# EasyEDA Pro project CALU_BMS_1_2_0_0.epro, schematic Active_Balancer

## Sheets
1 P1: Board Name: Active Balancer; Create Date: 2025-09-23; Page Name: P1; Project Name: CALU_BMS; Schematic Name: Active_Balancer; Update Date: 2025-10-01; Company: EasyEDA.com; Page Size: A4; Version: V1.0
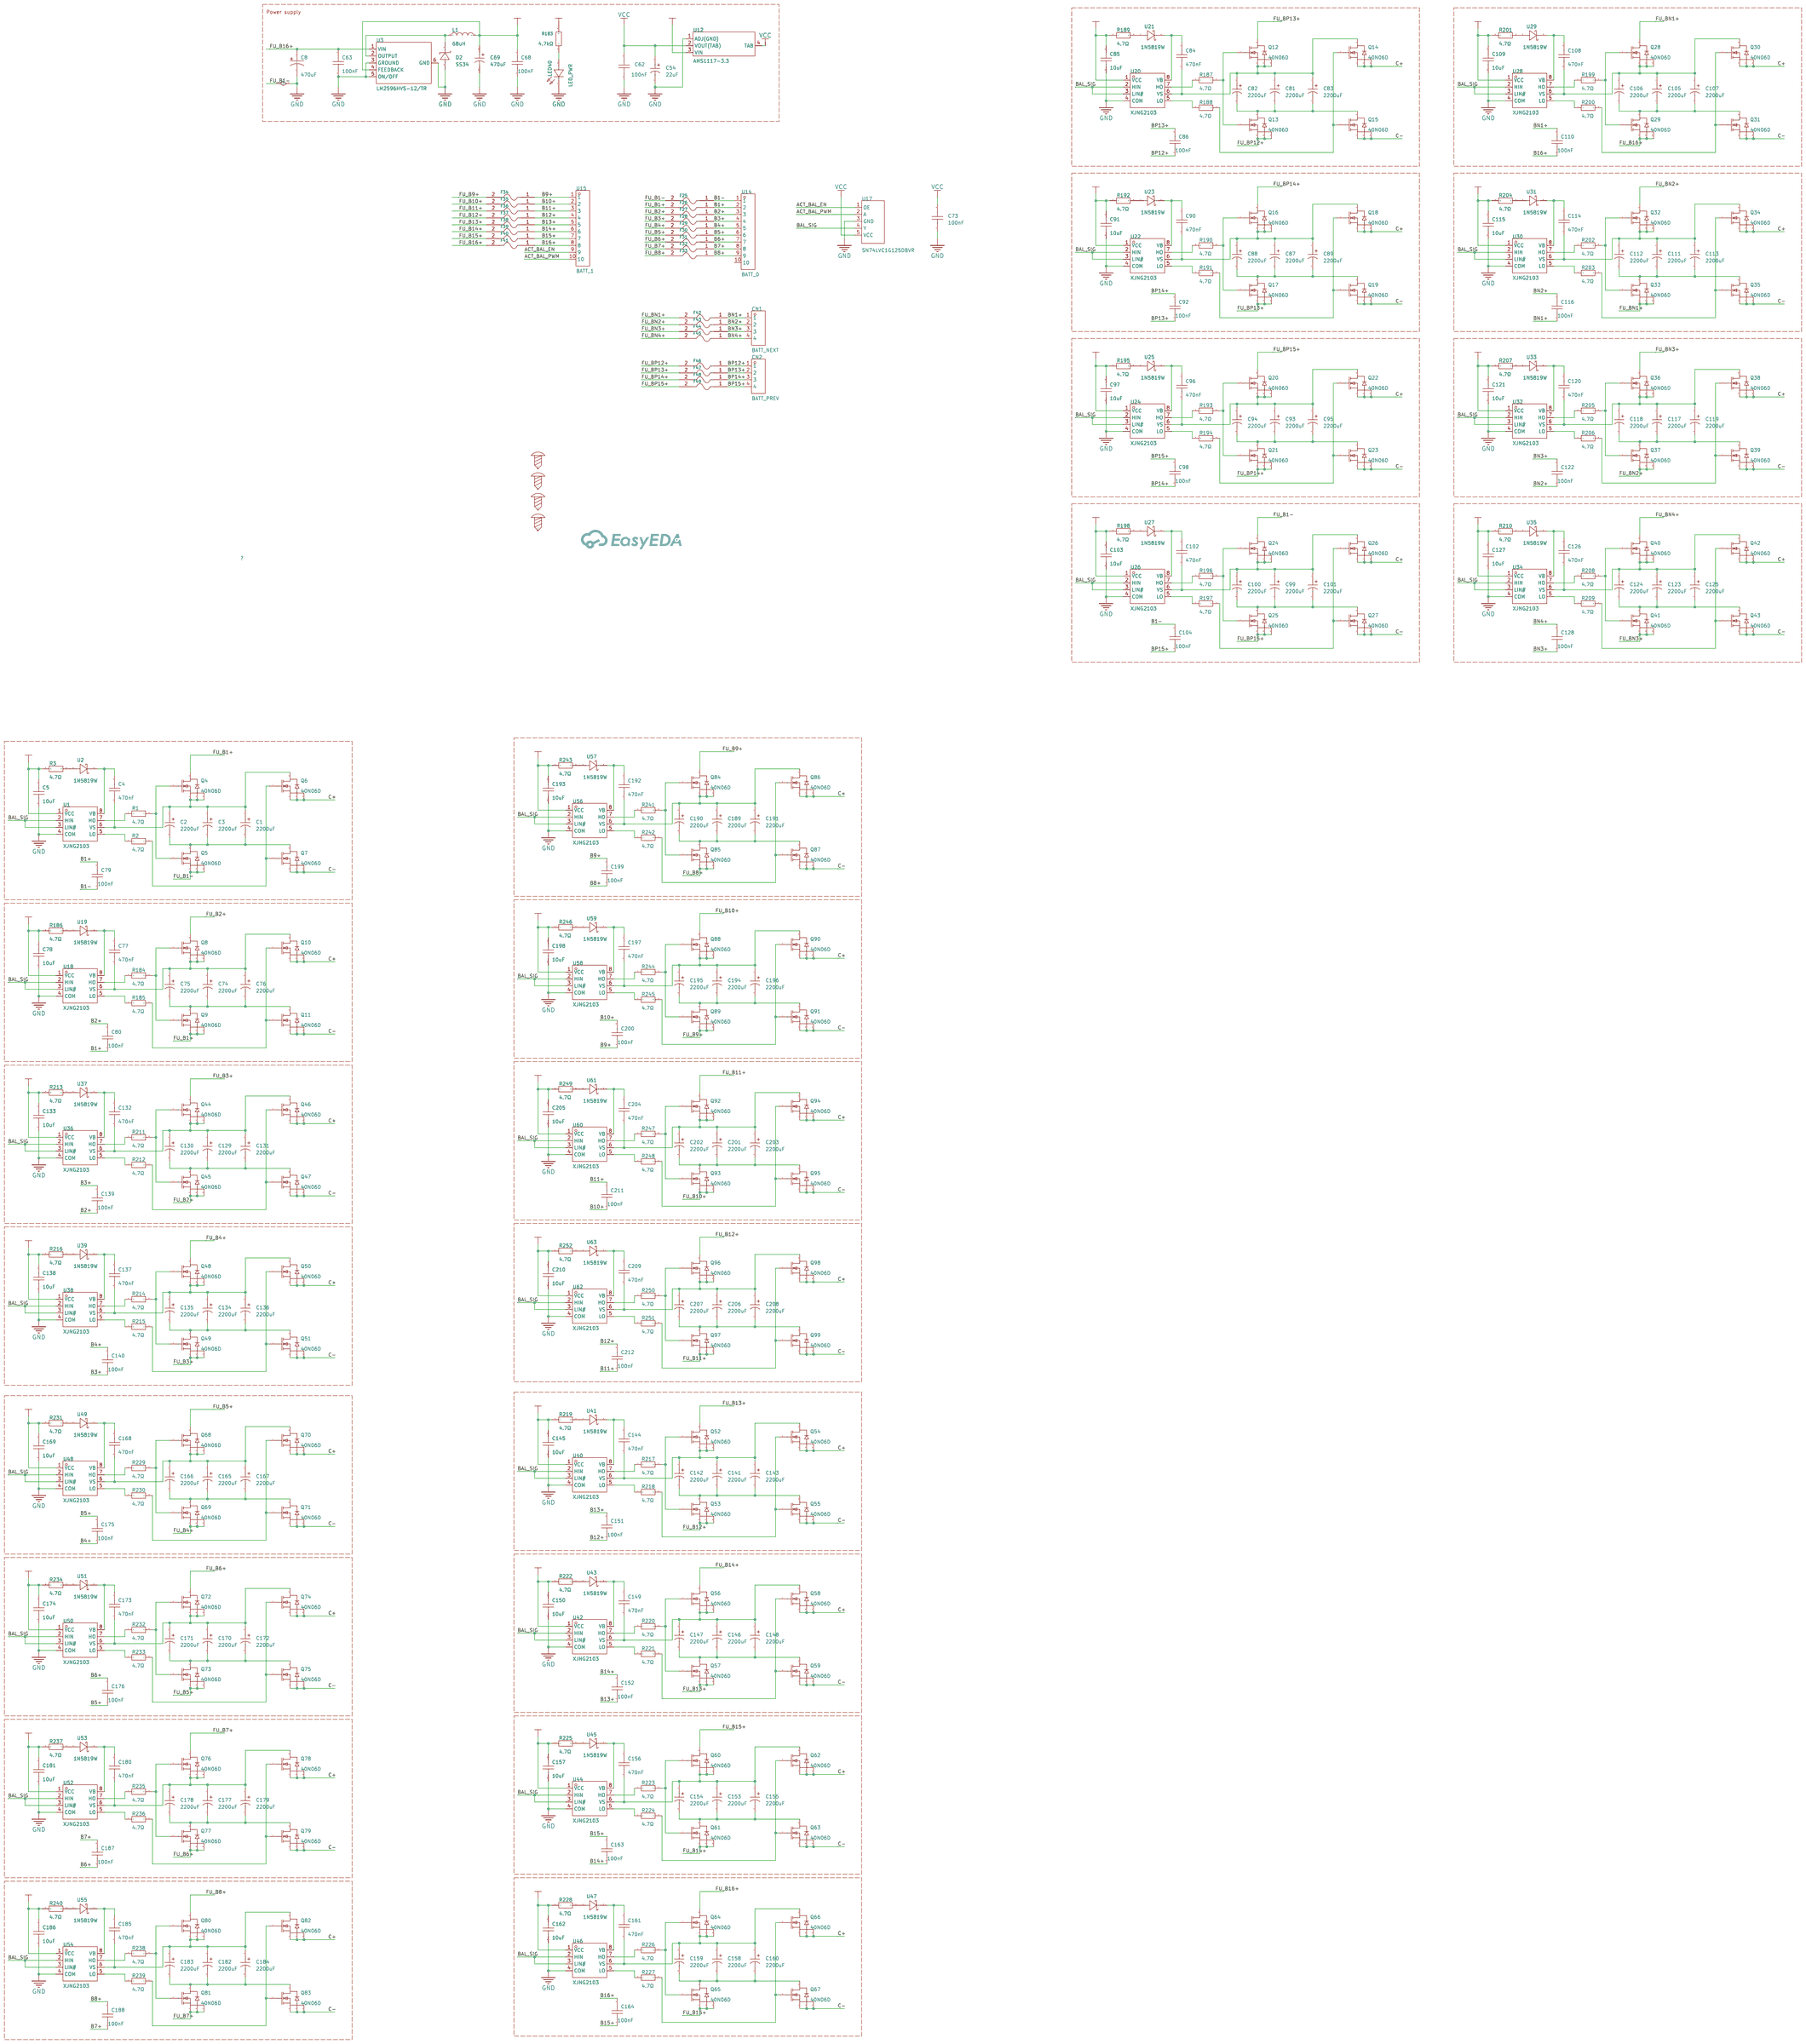
[diagram p4: P1]
2 P2: Project Name: Project Name; Schematic Name: Schematic Name; Update Date: 2021.11.05
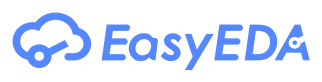
[diagram p5: P2]

## Parts
C1  2200uF  [CAP-SMD_BD10.0-L10.3-W10.3-LS11.0-FD]
C2  2200uF  [CAP-SMD_BD10.0-L10.3-W10.3-LS11.0-FD]
C3  2200uF  [CAP-SMD_BD10.0-L10.3-W10.3-LS11.0-FD]
C4  470nF  [C0603]
C5  10uF  [C0805]
C8  470uF  [CAP-SMD_BD16.0-L17.0-W17.0-FD-LS18.0]
C54  22uF  [CAP-SMD_BD5.0-L5.3-W5.3-LS6.0-FD]
C62  100nF  [C0603]
C63  100nF  [C0603]
C68  100nF  [C0603]
C69  470uF  [CAP-SMD_BD6.3-L6.6-W6.6-LS7.6-RD]
C73  100nF  [C0603]
C74  2200uF  [CAP-SMD_BD10.0-L10.3-W10.3-LS11.0-FD]
C75  2200uF  [CAP-SMD_BD10.0-L10.3-W10.3-LS11.0-FD]
C76  2200uF  [CAP-SMD_BD10.0-L10.3-W10.3-LS11.0-FD]
C77  470nF  [C0603]
C78  10uF  [C0805]
C79  100nF  [C0603]
C80  100nF  [C0603]
C81  2200uF  [CAP-SMD_BD10.0-L10.3-W10.3-LS11.0-FD]
C82  2200uF  [CAP-SMD_BD10.0-L10.3-W10.3-LS11.0-FD]
C83  2200uF  [CAP-SMD_BD10.0-L10.3-W10.3-LS11.0-FD]
C84  470nF  [C0603]
C85  10uF  [C0805]
C86  100nF  [C0603]
C87  2200uF  [CAP-SMD_BD10.0-L10.3-W10.3-LS11.0-FD]
C88  2200uF  [CAP-SMD_BD10.0-L10.3-W10.3-LS11.0-FD]
C89  2200uF  [CAP-SMD_BD10.0-L10.3-W10.3-LS11.0-FD]
C90  470nF  [C0603]
C91  10uF  [C0805]
C92  100nF  [C0603]
C93  2200uF  [CAP-SMD_BD10.0-L10.3-W10.3-LS11.0-FD]
C94  2200uF  [CAP-SMD_BD10.0-L10.3-W10.3-LS11.0-FD]
C95  2200uF  [CAP-SMD_BD10.0-L10.3-W10.3-LS11.0-FD]
C96  470nF  [C0603]
C97  10uF  [C0805]
C98  100nF  [C0603]
C99  2200uF  [CAP-SMD_BD10.0-L10.3-W10.3-LS11.0-FD]
C100  2200uF  [CAP-SMD_BD10.0-L10.3-W10.3-LS11.0-FD]
C101  2200uF  [CAP-SMD_BD10.0-L10.3-W10.3-LS11.0-FD]
C102  470nF  [C0603]
C103  10uF  [C0805]
C104  100nF  [C0603]
C105  2200uF  [CAP-SMD_BD10.0-L10.3-W10.3-LS11.0-FD]
C106  2200uF  [CAP-SMD_BD10.0-L10.3-W10.3-LS11.0-FD]
C107  2200uF  [CAP-SMD_BD10.0-L10.3-W10.3-LS11.0-FD]
C108  470nF  [C0603]
C109  10uF  [C0805]
C110  100nF  [C0603]
C111  2200uF  [CAP-SMD_BD10.0-L10.3-W10.3-LS11.0-FD]
C112  2200uF  [CAP-SMD_BD10.0-L10.3-W10.3-LS11.0-FD]
C113  2200uF  [CAP-SMD_BD10.0-L10.3-W10.3-LS11.0-FD]
C114  470nF  [C0603]
C115  10uF  [C0805]
C116  100nF  [C0603]
C117  2200uF  [CAP-SMD_BD10.0-L10.3-W10.3-LS11.0-FD]
C118  2200uF  [CAP-SMD_BD10.0-L10.3-W10.3-LS11.0-FD]
C119  2200uF  [CAP-SMD_BD10.0-L10.3-W10.3-LS11.0-FD]
C120  470nF  [C0603]
C121  10uF  [C0805]
C122  100nF  [C0603]
C123  2200uF  [CAP-SMD_BD10.0-L10.3-W10.3-LS11.0-FD]
C124  2200uF  [CAP-SMD_BD10.0-L10.3-W10.3-LS11.0-FD]
C125  2200uF  [CAP-SMD_BD10.0-L10.3-W10.3-LS11.0-FD]
C126  470nF  [C0603]
C127  10uF  [C0805]
C128  100nF  [C0603]
C129  2200uF  [CAP-SMD_BD10.0-L10.3-W10.3-LS11.0-FD]
C130  2200uF  [CAP-SMD_BD10.0-L10.3-W10.3-LS11.0-FD]
C131  2200uF  [CAP-SMD_BD10.0-L10.3-W10.3-LS11.0-FD]
C132  470nF  [C0603]
C133  10uF  [C0805]
C134  2200uF  [CAP-SMD_BD10.0-L10.3-W10.3-LS11.0-FD]
C135  2200uF  [CAP-SMD_BD10.0-L10.3-W10.3-LS11.0-FD]
C136  2200uF  [CAP-SMD_BD10.0-L10.3-W10.3-LS11.0-FD]
C137  470nF  [C0603]
C138  10uF  [C0805]
C139  100nF  [C0603]
C140  100nF  [C0603]
C141  2200uF  [CAP-SMD_BD10.0-L10.3-W10.3-LS11.0-FD]
C142  2200uF  [CAP-SMD_BD10.0-L10.3-W10.3-LS11.0-FD]
C143  2200uF  [CAP-SMD_BD10.0-L10.3-W10.3-LS11.0-FD]
C144  470nF  [C0603]
C145  10uF  [C0805]
C146  2200uF  [CAP-SMD_BD10.0-L10.3-W10.3-LS11.0-FD]
C147  2200uF  [CAP-SMD_BD10.0-L10.3-W10.3-LS11.0-FD]
C148  2200uF  [CAP-SMD_BD10.0-L10.3-W10.3-LS11.0-FD]
C149  470nF  [C0603]
C150  10uF  [C0805]
C151  100nF  [C0603]
C152  100nF  [C0603]
C153  2200uF  [CAP-SMD_BD10.0-L10.3-W10.3-LS11.0-FD]
C154  2200uF  [CAP-SMD_BD10.0-L10.3-W10.3-LS11.0-FD]
C155  2200uF  [CAP-SMD_BD10.0-L10.3-W10.3-LS11.0-FD]
C156  470nF  [C0603]
C157  10uF  [C0805]
C158  2200uF  [CAP-SMD_BD10.0-L10.3-W10.3-LS11.0-FD]
C159  2200uF  [CAP-SMD_BD10.0-L10.3-W10.3-LS11.0-FD]
C160  2200uF  [CAP-SMD_BD10.0-L10.3-W10.3-LS11.0-FD]
C161  470nF  [C0603]
C162  10uF  [C0805]
C163  100nF  [C0603]
C164  100nF  [C0603]
C165  2200uF  [CAP-SMD_BD10.0-L10.3-W10.3-LS11.0-FD]
C166  2200uF  [CAP-SMD_BD10.0-L10.3-W10.3-LS11.0-FD]
C167  2200uF  [CAP-SMD_BD10.0-L10.3-W10.3-LS11.0-FD]
C168  470nF  [C0603]
C169  10uF  [C0805]
C170  2200uF  [CAP-SMD_BD10.0-L10.3-W10.3-LS11.0-FD]
C171  2200uF  [CAP-SMD_BD10.0-L10.3-W10.3-LS11.0-FD]
C172  2200uF  [CAP-SMD_BD10.0-L10.3-W10.3-LS11.0-FD]
C173  470nF  [C0603]
C174  10uF  [C0805]
C175  100nF  [C0603]
C176  100nF  [C0603]
C177  2200uF  [CAP-SMD_BD10.0-L10.3-W10.3-LS11.0-FD]
C178  2200uF  [CAP-SMD_BD10.0-L10.3-W10.3-LS11.0-FD]
C179  2200uF  [CAP-SMD_BD10.0-L10.3-W10.3-LS11.0-FD]
C180  470nF  [C0603]
C181  10uF  [C0805]
C182  2200uF  [CAP-SMD_BD10.0-L10.3-W10.3-LS11.0-FD]
C183  2200uF  [CAP-SMD_BD10.0-L10.3-W10.3-LS11.0-FD]
C184  2200uF  [CAP-SMD_BD10.0-L10.3-W10.3-LS11.0-FD]
C185  470nF  [C0603]
C186  10uF  [C0805]
C187  100nF  [C0603]
C188  100nF  [C0603]
C189  2200uF  [CAP-SMD_BD10.0-L10.3-W10.3-LS11.0-FD]
C190  2200uF  [CAP-SMD_BD10.0-L10.3-W10.3-LS11.0-FD]
C191  2200uF  [CAP-SMD_BD10.0-L10.3-W10.3-LS11.0-FD]
C192  470nF  [C0603]
C193  10uF  [C0805]
C194  2200uF  [CAP-SMD_BD10.0-L10.3-W10.3-LS11.0-FD]
C195  2200uF  [CAP-SMD_BD10.0-L10.3-W10.3-LS11.0-FD]
C196  2200uF  [CAP-SMD_BD10.0-L10.3-W10.3-LS11.0-FD]
C197  470nF  [C0603]
C198  10uF  [C0805]
C199  100nF  [C0603]
C200  100nF  [C0603]
C201  2200uF  [CAP-SMD_BD10.0-L10.3-W10.3-LS11.0-FD]
C202  2200uF  [CAP-SMD_BD10.0-L10.3-W10.3-LS11.0-FD]
C203  2200uF  [CAP-SMD_BD10.0-L10.3-W10.3-LS11.0-FD]
C204  470nF  [C0603]
C205  10uF  [C0805]
C206  2200uF  [CAP-SMD_BD10.0-L10.3-W10.3-LS11.0-FD]
C207  2200uF  [CAP-SMD_BD10.0-L10.3-W10.3-LS11.0-FD]
C208  2200uF  [CAP-SMD_BD10.0-L10.3-W10.3-LS11.0-FD]
C209  470nF  [C0603]
C210  10uF  [C0805]
C211  100nF  [C0603]
C212  100nF  [C0603]
CN1  BATT_NEXT  [CONN-TH_4P-P3.50_MAX_MX15EDGRM-3.5-04P-GN01-CU-A]
CN2  BATT_PREV  [CONN-TH_4P-P3.50_MAX_MX15EDGRM-3.5-04P-GN01-CU-A]
D2  SS34  [SMA_L4.3-W2.6-LS5.2-RD]
F25  SMD1206P005TF  [F1206]
F26  SMD1206P005TF  [F1206]
F27  SMD1206P005TF  [F1206]
F28  SMD1206P005TF  [F1206]
F29  SMD1206P005TF  [F1206]
F30  SMD1206P005TF  [F1206]
F31  SMD1206P005TF  [F1206]
F32  SMD1206P005TF  [F1206]
F33  SMD1206P005TF  [F1206]
F34  SMD1206P005TF  [F1206]
F35  SMD1206P005TF  [F1206]
F36  SMD1206P005TF  [F1206]
F37  SMD1206P005TF  [F1206]
F38  SMD1206P005TF  [F1206]
F39  SMD1206P005TF  [F1206]
F40  SMD1206P005TF  [F1206]
F41  SMD1206P005TF  [F1206]
F42  SMD1206P005TF  [F1206]
F43  SMD1206P005TF  [F1206]
F44  SMD1206P005TF  [F1206]
F45  SMD1206P005TF  [F1206]
F46  SMD1206P005TF  [F1206]
F47  SMD1206P005TF  [F1206]
F48  SMD1206P005TF  [F1206]
F49  SMD1206P005TF  [F1206]
L1  68uH  [IND-SMD_L12.5-W12.5]
LED40  LED_PWR  [LED0603-RD-YELLOW]
Q4  40N06D  [WDFN-5_L3.1-W3.1-P0.65-BL_1]
Q5  40N06D  [WDFN-5_L3.1-W3.1-P0.65-BL_1]
Q6  40N06D  [WDFN-5_L3.1-W3.1-P0.65-BL_1]
Q7  40N06D  [WDFN-5_L3.1-W3.1-P0.65-BL_1]
Q8  40N06D  [WDFN-5_L3.1-W3.1-P0.65-BL_1]
Q9  40N06D  [WDFN-5_L3.1-W3.1-P0.65-BL_1]
Q10  40N06D  [WDFN-5_L3.1-W3.1-P0.65-BL_1]
Q11  40N06D  [WDFN-5_L3.1-W3.1-P0.65-BL_1]
Q12  40N06D  [WDFN-5_L3.1-W3.1-P0.65-BL_1]
Q13  40N06D  [WDFN-5_L3.1-W3.1-P0.65-BL_1]
Q14  40N06D  [WDFN-5_L3.1-W3.1-P0.65-BL_1]
Q15  40N06D  [WDFN-5_L3.1-W3.1-P0.65-BL_1]
Q16  40N06D  [WDFN-5_L3.1-W3.1-P0.65-BL_1]
Q17  40N06D  [WDFN-5_L3.1-W3.1-P0.65-BL_1]
Q18  40N06D  [WDFN-5_L3.1-W3.1-P0.65-BL_1]
Q19  40N06D  [WDFN-5_L3.1-W3.1-P0.65-BL_1]
Q20  40N06D  [WDFN-5_L3.1-W3.1-P0.65-BL_1]
Q21  40N06D  [WDFN-5_L3.1-W3.1-P0.65-BL_1]
Q22  40N06D  [WDFN-5_L3.1-W3.1-P0.65-BL_1]
Q23  40N06D  [WDFN-5_L3.1-W3.1-P0.65-BL_1]
Q24  40N06D  [WDFN-5_L3.1-W3.1-P0.65-BL_1]
Q25  40N06D  [WDFN-5_L3.1-W3.1-P0.65-BL_1]
Q26  40N06D  [WDFN-5_L3.1-W3.1-P0.65-BL_1]
Q27  40N06D  [WDFN-5_L3.1-W3.1-P0.65-BL_1]
Q28  40N06D  [WDFN-5_L3.1-W3.1-P0.65-BL_1]
Q29  40N06D  [WDFN-5_L3.1-W3.1-P0.65-BL_1]
Q30  40N06D  [WDFN-5_L3.1-W3.1-P0.65-BL_1]
Q31  40N06D  [WDFN-5_L3.1-W3.1-P0.65-BL_1]
Q32  40N06D  [WDFN-5_L3.1-W3.1-P0.65-BL_1]
Q33  40N06D  [WDFN-5_L3.1-W3.1-P0.65-BL_1]
Q34  40N06D  [WDFN-5_L3.1-W3.1-P0.65-BL_1]
Q35  40N06D  [WDFN-5_L3.1-W3.1-P0.65-BL_1]
Q36  40N06D  [WDFN-5_L3.1-W3.1-P0.65-BL_1]
Q37  40N06D  [WDFN-5_L3.1-W3.1-P0.65-BL_1]
Q38  40N06D  [WDFN-5_L3.1-W3.1-P0.65-BL_1]
Q39  40N06D  [WDFN-5_L3.1-W3.1-P0.65-BL_1]
Q40  40N06D  [WDFN-5_L3.1-W3.1-P0.65-BL_1]
Q41  40N06D  [WDFN-5_L3.1-W3.1-P0.65-BL_1]
Q42  40N06D  [WDFN-5_L3.1-W3.1-P0.65-BL_1]
Q43  40N06D  [WDFN-5_L3.1-W3.1-P0.65-BL_1]
Q44  40N06D  [WDFN-5_L3.1-W3.1-P0.65-BL_1]
Q45  40N06D  [WDFN-5_L3.1-W3.1-P0.65-BL_1]
Q46  40N06D  [WDFN-5_L3.1-W3.1-P0.65-BL_1]
Q47  40N06D  [WDFN-5_L3.1-W3.1-P0.65-BL_1]
Q48  40N06D  [WDFN-5_L3.1-W3.1-P0.65-BL_1]
Q49  40N06D  [WDFN-5_L3.1-W3.1-P0.65-BL_1]
Q50  40N06D  [WDFN-5_L3.1-W3.1-P0.65-BL_1]
Q51  40N06D  [WDFN-5_L3.1-W3.1-P0.65-BL_1]
Q52  40N06D  [WDFN-5_L3.1-W3.1-P0.65-BL_1]
Q53  40N06D  [WDFN-5_L3.1-W3.1-P0.65-BL_1]
Q54  40N06D  [WDFN-5_L3.1-W3.1-P0.65-BL_1]
Q55  40N06D  [WDFN-5_L3.1-W3.1-P0.65-BL_1]
Q56  40N06D  [WDFN-5_L3.1-W3.1-P0.65-BL_1]
Q57  40N06D  [WDFN-5_L3.1-W3.1-P0.65-BL_1]
Q58  40N06D  [WDFN-5_L3.1-W3.1-P0.65-BL_1]
Q59  40N06D  [WDFN-5_L3.1-W3.1-P0.65-BL_1]
Q60  40N06D  [WDFN-5_L3.1-W3.1-P0.65-BL_1]
Q61  40N06D  [WDFN-5_L3.1-W3.1-P0.65-BL_1]
Q62  40N06D  [WDFN-5_L3.1-W3.1-P0.65-BL_1]
Q63  40N06D  [WDFN-5_L3.1-W3.1-P0.65-BL_1]
Q64  40N06D  [WDFN-5_L3.1-W3.1-P0.65-BL_1]
Q65  40N06D  [WDFN-5_L3.1-W3.1-P0.65-BL_1]
Q66  40N06D  [WDFN-5_L3.1-W3.1-P0.65-BL_1]
Q67  40N06D  [WDFN-5_L3.1-W3.1-P0.65-BL_1]
Q68  40N06D  [WDFN-5_L3.1-W3.1-P0.65-BL_1]
Q69  40N06D  [WDFN-5_L3.1-W3.1-P0.65-BL_1]
Q70  40N06D  [WDFN-5_L3.1-W3.1-P0.65-BL_1]
Q71  40N06D  [WDFN-5_L3.1-W3.1-P0.65-BL_1]
Q72  40N06D  [WDFN-5_L3.1-W3.1-P0.65-BL_1]
Q73  40N06D  [WDFN-5_L3.1-W3.1-P0.65-BL_1]
Q74  40N06D  [WDFN-5_L3.1-W3.1-P0.65-BL_1]
Q75  40N06D  [WDFN-5_L3.1-W3.1-P0.65-BL_1]
Q76  40N06D  [WDFN-5_L3.1-W3.1-P0.65-BL_1]
Q77  40N06D  [WDFN-5_L3.1-W3.1-P0.65-BL_1]
Q78  40N06D  [WDFN-5_L3.1-W3.1-P0.65-BL_1]
Q79  40N06D  [WDFN-5_L3.1-W3.1-P0.65-BL_1]
Q80  40N06D  [WDFN-5_L3.1-W3.1-P0.65-BL_1]
Q81  40N06D  [WDFN-5_L3.1-W3.1-P0.65-BL_1]
Q82  40N06D  [WDFN-5_L3.1-W3.1-P0.65-BL_1]
Q83  40N06D  [WDFN-5_L3.1-W3.1-P0.65-BL_1]
Q84  40N06D  [WDFN-5_L3.1-W3.1-P0.65-BL_1]
Q85  40N06D  [WDFN-5_L3.1-W3.1-P0.65-BL_1]
Q86  40N06D  [WDFN-5_L3.1-W3.1-P0.65-BL_1]
Q87  40N06D  [WDFN-5_L3.1-W3.1-P0.65-BL_1]
Q88  40N06D  [WDFN-5_L3.1-W3.1-P0.65-BL_1]
Q89  40N06D  [WDFN-5_L3.1-W3.1-P0.65-BL_1]
Q90  40N06D  [WDFN-5_L3.1-W3.1-P0.65-BL_1]
Q91  40N06D  [WDFN-5_L3.1-W3.1-P0.65-BL_1]
Q92  40N06D  [WDFN-5_L3.1-W3.1-P0.65-BL_1]
Q93  40N06D  [WDFN-5_L3.1-W3.1-P0.65-BL_1]
Q94  40N06D  [WDFN-5_L3.1-W3.1-P0.65-BL_1]
Q95  40N06D  [WDFN-5_L3.1-W3.1-P0.65-BL_1]
Q96  40N06D  [WDFN-5_L3.1-W3.1-P0.65-BL_1]
Q97  40N06D  [WDFN-5_L3.1-W3.1-P0.65-BL_1]
Q98  40N06D  [WDFN-5_L3.1-W3.1-P0.65-BL_1]
Q99  40N06D  [WDFN-5_L3.1-W3.1-P0.65-BL_1]
R1  4.7Ω  [R0603]
R2  4.7Ω  [R0603]
R3  4.7Ω  [R0603]
R183  4.7kΩ  [R0603]
R184  4.7Ω  [R0603]
R185  4.7Ω  [R0603]
R186  4.7Ω  [R0603]
R187  4.7Ω  [R0603]
R188  4.7Ω  [R0603]
R189  4.7Ω  [R0603]
R190  4.7Ω  [R0603]
R191  4.7Ω  [R0603]
R192  4.7Ω  [R0603]
R193  4.7Ω  [R0603]
R194  4.7Ω  [R0603]
R195  4.7Ω  [R0603]
R196  4.7Ω  [R0603]
R197  4.7Ω  [R0603]
R198  4.7Ω  [R0603]
R199  4.7Ω  [R0603]
R200  4.7Ω  [R0603]
R201  4.7Ω  [R0603]
R202  4.7Ω  [R0603]
R203  4.7Ω  [R0603]
R204  4.7Ω  [R0603]
R205  4.7Ω  [R0603]
R206  4.7Ω  [R0603]
R207  4.7Ω  [R0603]
R208  4.7Ω  [R0603]
R209  4.7Ω  [R0603]
R210  4.7Ω  [R0603]
R211  4.7Ω  [R0603]
R212  4.7Ω  [R0603]
R213  4.7Ω  [R0603]
R214  4.7Ω  [R0603]
R215  4.7Ω  [R0603]
R216  4.7Ω  [R0603]
R217  4.7Ω  [R0603]
R218  4.7Ω  [R0603]
R219  4.7Ω  [R0603]
R220  4.7Ω  [R0603]
R221  4.7Ω  [R0603]
R222  4.7Ω  [R0603]
R223  4.7Ω  [R0603]
R224  4.7Ω  [R0603]
R225  4.7Ω  [R0603]
R226  4.7Ω  [R0603]
R227  4.7Ω  [R0603]
R228  4.7Ω  [R0603]
R229  4.7Ω  [R0603]
R230  4.7Ω  [R0603]
R231  4.7Ω  [R0603]
R232  4.7Ω  [R0603]
R233  4.7Ω  [R0603]
R234  4.7Ω  [R0603]
R235  4.7Ω  [R0603]
R236  4.7Ω  [R0603]
R237  4.7Ω  [R0603]
R238  4.7Ω  [R0603]
R239  4.7Ω  [R0603]
R240  4.7Ω  [R0603]
R241  4.7Ω  [R0603]
R242  4.7Ω  [R0603]
R243  4.7Ω  [R0603]
R244  4.7Ω  [R0603]
R245  4.7Ω  [R0603]
R246  4.7Ω  [R0603]
R247  4.7Ω  [R0603]
R248  4.7Ω  [R0603]
R249  4.7Ω  [R0603]
R250  4.7Ω  [R0603]
R251  4.7Ω  [R0603]
R252  4.7Ω  [R0603]
SCREW1  -  [Screw-Hole-M4]
SCREW2  -  [Screw-Hole-M4]
SCREW3  -  [Screw-Hole-M4]
SCREW4  -  [Screw-Hole-M4]
U1  XJNG2103  [SOIC-8_L4.9-W3.9-P1.27-LS6.0-BL]
U2  1N5819W  [SOD-123_L2.7-W1.6-LS3.7-FD]
U3  LM2596HVS-12/TR  [TO-263-5_L10.6-W9.6-P1.70-LS15.9-BR]
U12  AMS1117-3.3  [SOT-223-4_L6.5-W3.5-P2.30-LS7.0-BR]
U14  BATT_0  [CONN-TH_10P-P3.50_MX15EDGRM-3.5-10P-GN01-CU-A]
U15  BATT_1  [CONN-TH_10P-P3.50_MX15EDGRM-3.5-10P-GN01-CU-A]
U17  SN74LVC1G125DBVR  [SOT-23-5_L3.0-W1.7-P0.95-LS2.8-BL]
U18  XJNG2103  [SOIC-8_L4.9-W3.9-P1.27-LS6.0-BL]
U19  1N5819W  [SOD-123_L2.7-W1.6-LS3.7-FD]
U20  XJNG2103  [SOIC-8_L4.9-W3.9-P1.27-LS6.0-BL]
U21  1N5819W  [SOD-123_L2.7-W1.6-LS3.7-FD]
U22  XJNG2103  [SOIC-8_L4.9-W3.9-P1.27-LS6.0-BL]
U23  1N5819W  [SOD-123_L2.7-W1.6-LS3.7-FD]
U24  XJNG2103  [SOIC-8_L4.9-W3.9-P1.27-LS6.0-BL]
U25  1N5819W  [SOD-123_L2.7-W1.6-LS3.7-FD]
U26  XJNG2103  [SOIC-8_L4.9-W3.9-P1.27-LS6.0-BL]
U27  1N5819W  [SOD-123_L2.7-W1.6-LS3.7-FD]
U28  XJNG2103  [SOIC-8_L4.9-W3.9-P1.27-LS6.0-BL]
U29  1N5819W  [SOD-123_L2.7-W1.6-LS3.7-FD]
U30  XJNG2103  [SOIC-8_L4.9-W3.9-P1.27-LS6.0-BL]
U31  1N5819W  [SOD-123_L2.7-W1.6-LS3.7-FD]
U32  XJNG2103  [SOIC-8_L4.9-W3.9-P1.27-LS6.0-BL]
U33  1N5819W  [SOD-123_L2.7-W1.6-LS3.7-FD]
U34  XJNG2103  [SOIC-8_L4.9-W3.9-P1.27-LS6.0-BL]
U35  1N5819W  [SOD-123_L2.7-W1.6-LS3.7-FD]
U36  XJNG2103  [SOIC-8_L4.9-W3.9-P1.27-LS6.0-BL]
U37  1N5819W  [SOD-123_L2.7-W1.6-LS3.7-FD]
U38  XJNG2103  [SOIC-8_L4.9-W3.9-P1.27-LS6.0-BL]
U39  1N5819W  [SOD-123_L2.7-W1.6-LS3.7-FD]
U40  XJNG2103  [SOIC-8_L4.9-W3.9-P1.27-LS6.0-BL]
U41  1N5819W  [SOD-123_L2.7-W1.6-LS3.7-FD]
U42  XJNG2103  [SOIC-8_L4.9-W3.9-P1.27-LS6.0-BL]
U43  1N5819W  [SOD-123_L2.7-W1.6-LS3.7-FD]
U44  XJNG2103  [SOIC-8_L4.9-W3.9-P1.27-LS6.0-BL]
U45  1N5819W  [SOD-123_L2.7-W1.6-LS3.7-FD]
U46  XJNG2103  [SOIC-8_L4.9-W3.9-P1.27-LS6.0-BL]
U47  1N5819W  [SOD-123_L2.7-W1.6-LS3.7-FD]
U48  XJNG2103  [SOIC-8_L4.9-W3.9-P1.27-LS6.0-BL]
U49  1N5819W  [SOD-123_L2.7-W1.6-LS3.7-FD]
U50  XJNG2103  [SOIC-8_L4.9-W3.9-P1.27-LS6.0-BL]
U51  1N5819W  [SOD-123_L2.7-W1.6-LS3.7-FD]
U52  XJNG2103  [SOIC-8_L4.9-W3.9-P1.27-LS6.0-BL]
U53  1N5819W  [SOD-123_L2.7-W1.6-LS3.7-FD]
U54  XJNG2103  [SOIC-8_L4.9-W3.9-P1.27-LS6.0-BL]
U55  1N5819W  [SOD-123_L2.7-W1.6-LS3.7-FD]
U56  XJNG2103  [SOIC-8_L4.9-W3.9-P1.27-LS6.0-BL]
U57  1N5819W  [SOD-123_L2.7-W1.6-LS3.7-FD]
U58  XJNG2103  [SOIC-8_L4.9-W3.9-P1.27-LS6.0-BL]
U59  1N5819W  [SOD-123_L2.7-W1.6-LS3.7-FD]
U60  XJNG2103  [SOIC-8_L4.9-W3.9-P1.27-LS6.0-BL]
U61  1N5819W  [SOD-123_L2.7-W1.6-LS3.7-FD]
U62  XJNG2103  [SOIC-8_L4.9-W3.9-P1.27-LS6.0-BL]
U63  1N5819W  [SOD-123_L2.7-W1.6-LS3.7-FD]

## Library data of the parts
C1-C3 C74-C76 C81-C83 C87-C89 C93-C95 C99-C101 C105-C107 C111-C113 C117-C119 C123-C125 C129-C131 C134-C136 C141-C143 C146-C148 C153-C155 C158-C160 C165-C167 C170-C172 C177-C179 C182-C184 C189-C191 C194-C196 C201-C203 C206-C208 = GVM0J228M1010CN: Capacitance:2200uF Tolerance:±20% Tolerance:±20% Voltage Rating:6.3V Ripple Current:1.19A@100kHz Diameter:10mm Height - Seated (Max):10.5mm; LCSC Part Name: 2200uF ±20% 6.3V; Supplier Part: C22383517; Manufacturer: ACMECON(鼎容); Supplier Footprint: SMD,D10xL10.5mm; JLCPCB Part Class: Extended Part; Datasheet: https://item.szlcsc.com/datasheet/GVM0J228M1010CN/23927502.html; Supplier: LCSC; Tolerance: ±20%; Voltage Rating: 6.3V; Ripple Current: 1.19A@100kHz; Diameter: 10mm; Height - Seated (Max): 10.5mm
C4 C77 C84 C90 C96 C102 C108 C114 C120 C126 C132 C137 C144 C149 C156 C161 C168 C173 C180 C185 C192 C197 C204 C209 = CAP_0603: Supplier Footprint: 0603
C5 C78 C85 C91 C97 C103 C109 C115 C121 C127 C133 C138 C145 C150 C157 C162 C169 C174 C181 C186 C193 C198 C205 C210 = CAP_0805: Supplier Footprint: 0805
C8 = VZH471M1JTR-1616: Capacitance:470uF Tolerance:±20% Tolerance:±20% Voltage Rating:63V Ripple Current:- Equivalent Series Resistance(ESR):- Diameter:16mm Height - Seated (Max):16.5mm Lifetime:5000hrs@105℃ Operating Temperature:-45℃~+105℃ Operating Temperature:-45℃~+105℃; LCSC Part Name: 470uF ±20% 63V; Supplier Part: C249935; Manufacturer: Lelon(立隆); Supplier Footprint: SMD,D16xL16.5mm; JLCPCB Part Class: Extended Part; Datasheet: https://atta.szlcsc.com/upload/public/pdf/source/20181115/C249956_178B4AAE514BBF17AF6A9453F96D6C96.pdf; Supplier: LCSC; Tolerance: ±20%; Voltage Rating: 63V; Diameter: 16mm; Height - Seated (Max): 16.5mm; Lifetime: 5000hrs@105℃; Operating Temperature: -45℃~+105℃
C54 = CS1E220M-CRD54_C3001207: Capacitance:22uF Tolerance:±20% Tolerance:±20% Voltage Rating:25V Ripple Current:25mA@120Hz Diameter:5mm Height - Seated (Max):5.4mm Lifetime:2000hrs@105℃ Operating Temperature:-40℃~+105℃ Operating Temperature:-40℃~+105℃; LCSC Part Name: 22uF ±20% 25V; Supplier Part: C3001207; Manufacturer: ROQANG(容强); Manufacturer Part: CS1E220M-CRD54; Supplier Footprint: SMD,D5xL5.4mm; JLCPCB Part Class: Extended Part; Datasheet: https://item.szlcsc.com/datasheet/CS1E220M-CRD54/3483887.html; Supplier: LCSC; Tolerance: ±20%; Voltage Rating: 25V; Ripple Current: 25mA@120Hz; Diameter: 5mm; Height - Seated (Max): 5.4mm; Lifetime: 2000hrs@105℃; Operating Temperature: -40℃~+105℃
C62 C63 C68 C73 C79 C80 C86 C92 C98 C104 C110 C116 C122 C128 C139 C140 C151 C152 C163 C164 C175 C176 C187 C188 C199 C200 C211 C212 = CC0603KRX7R9BB104: Capacitance:100nF Tolerance:±10% Tolerance:±10% Voltage Rating:50V Temperature Coefficient:X7R; LCSC Part Name: 100nF ±10% 50V; Supplier Part: C14663; Manufacturer: YAGEO(国巨); Supplier Footprint: 0603; JLCPCB Part Class: Basic Part; Datasheet: https://item.szlcsc.com/datasheet/CC0603KRX7R9BB104/15331.html; Supplier: LCSC; Tolerance: ±10%; Voltage Rating: 50V; Temperature Coefficient: X7R
C69 = RVT1C471M0607: Capacitance:470uF Tolerance:±20% Tolerance:±20% Voltage Rating:16V Ripple Current:185mA@120Hz Diameter:6.3mm Height - Seated (Max):7.7mm Lifetime:2000hrs@105℃ Operating Temperature:-40℃~+105℃ Operating Temperature:-40℃~+105℃; LCSC Part Name: 470uF ±20% 16V; Supplier Part: C2977552; Manufacturer: ROQANG(容强); Supplier Footprint: SMD,D6.3xL7.7mm; JLCPCB Part Class: Extended Part; Datasheet: https://item.szlcsc.com/datasheet/RVT1C471M0607/3388608.html; Supplier: LCSC; Tolerance: ±20%; Voltage Rating: 16V; Ripple Current: 185mA@120Hz; Diameter: 6.3mm; Height - Seated (Max): 7.7mm; Lifetime: 2000hrs@105℃; Operating Temperature: -40℃~+105℃
CN1 CN2 = MX15EDGRM-3.5-04P-GN01-Cu-A: Connector Type:Board Side/Socket - Closed Termination Style:Screw Number of Positions or Pins:1x4P Pitch:3.5mm Color:Green Mounting Type:Right-Angle Pin Number of Pins:4P Number of Rows:1 Number of PINs Per Row:4 Current Rating:8A Voltage Rating (Max):300; LCSC Part Name: 螺丝固定 1x4P 3.5mm 排数:1 每排P数:4; Supplier Part: C5188343; Manufacturer: MAX(迈旭); Supplier Footprint: 弯插,P=3.5mm; JLCPCB Part Class: Extended Part; Datasheet: https://item.szlcsc.com/datasheet/MX15EDGRM-3.5-04P-GN01-Cu-A/5862427.html; Supplier: LCSC; Connector Type: Board Side/Socket - Closed; Termination Style: Screw; Number of Positions or Pins: 1x4P; Pitch: 3.5mm; Color: Green; Mounting Type: Right-Angle Pin; Number of Pins: 4P; Number of Rows: 1; Number of PINs Per Row: 4; Current Rating: 8A; Voltage Rating (Max): 300V; Operating Temperature: -40℃~+105℃
D2 = SS34_C8678: Diode Configuration:Independent Voltage - Forward(Vf@If):550mV@3A Voltage - DC Reverse(Vr):40V Current - Rectified:3A Reverse Leakage Current (Ir):500uA@40V Operating Junction Temperature Range:-55℃~+125℃ Operating Junction Temperature Range:-55℃~+125℃; LCSC Part Name: 电压:40V 电流:3A; Supplier Part: C8678; Manufacturer: MDD(辰达半导体); Supplier Footprint: SMA(DO-214AC); JLCPCB Part Class: Basic Part; Datasheet: https://item.szlcsc.com/datasheet/SS34/9178.html; Supplier: LCSC; Diode Configuration: Independent; Voltage - Forward(Vf@If): 550mV@3A; Voltage - DC Reverse(Vr): 40V; Current - Rectified: 3A; Reverse Leakage Current (Ir): 500uA@40V; Operating Junction Temperature Range: -55℃~+125℃
F25-F49 = SMD1206P005TF_C20797: Voltage - Max:60V Current - Max:10A Hold Current:50mA Trip Current:250mA Power Dissipation:400mW Resistance - Initial (Ri) (Min):1.6Ω Resistance - Post Trip (R1) (Max):15Ω Time to Trip(Max):1s Operating Temperature:-40℃~+85℃ Operating Temperature:-40℃~+85; LCSC Part Name: 60V 50mA 1206自恢复; Supplier Part: C20797; Manufacturer: RUILON(瑞隆源); Supplier Footprint: 1206; JLCPCB Part Class: Extended Part; Datasheet: https://item.szlcsc.com/datasheet/SMD1206P005TF/21509.html; Supplier: LCSC; Voltage - Max: 60V; Current - Max: 10A; Hold Current: 50mA; Trip Current: 250mA; Power Dissipation: 400mW; Resistance - Initial (Ri) (Min): 1.6Ω; Resistance - Post Trip (R1) (Max): 15Ω; Time to Trip(Max): 1s; Operating Temperature: -40℃~+85℃
L1 = CYH125-68UH: Inductance: Tolerance:±20% Tolerance:±20% Rated Current: DC Resistance (DCR):64.8mΩ; LCSC Part Name: 68uH ±20%; Supplier Part: C7431083; Manufacturer: SHOU HAN(首韩); Supplier Footprint: SMD,12.5x12.5mm; JLCPCB Part Class: Extended Part; Datasheet: https://atta.szlcsc.com/upload/public/pdf/source/20230621/00B923FD072A2FA4420B8D9BC7718C72.pdf; Supplier: LCSC; Tolerance: ±20%; DC Resistance (DCR): 64.8mΩ
LED40 = APTD1608LZGCK: Illumination Color:Emerald Green Voltage - Forward(Vf):2.65V Voltage - Forward(Vf):2.65V Power(Watts):102.5mW Forward Current:2mA Wavelength - Dominant:525nm Wavelength - Dominant:525nm Peak Wavelength:515nm Lens Color:Water Clear Luminous Intensity:420mc; Supplier Part: C5569567; Manufacturer: Kingbright; Supplier Footprint: 0603; JLCPCB Part Class: Extended Part; Datasheet: https://item.szlcsc.com/datasheet/APTD1608LZGCK/6487941.html; Supplier: LCSC; Illumination Color: Emerald Green; Voltage - Forward(Vf): 2.65V; Power(Watts): 102.5mW; Forward Current: 2mA; Wavelength - Dominant: 525nm; Peak Wavelength: 515nm; Lens Color: Water Clear; Luminous Intensity: 420mcd; Viewing Angle: 60°; Operating Temperature: -40℃~+85℃
Q4-Q99 = 40N06D: Number:1 N-Channel Drain to Source Voltage:60V Current - Continuous Drain(Id):40A RDS(on):12mΩ Gate Threshold Voltage (Vgs(th)):2.5V; LCSC Part Name: 1个N沟道 耐压:60V 电流:40A; Supplier Part: C7543836; Manufacturer: HL(富海微); Supplier Footprint: PDFN-8(3x3); JLCPCB Part Class: Extended Part; Datasheet: https://item.szlcsc.com/datasheet/40N06D/8649553.html; Supplier: LCSC; Number: 1 N-Channel; Drain to Source Voltage: 60V; Current - Continuous Drain(Id): 40A; RDS(on): 12mΩ; Gate Threshold Voltage (Vgs(th)): 2.5V
R1-R3 R184-R252 = Res_0603: Supplier Footprint: 0603
R183 = SCR0603J4K7: Type:Thick Film Resistors Resistance: Tolerance:±5% Tolerance:±5% Power(Watts): Overload Voltage (Max): Operating Temperature Range:-55℃~+155℃ Operating Temperature Range:-55℃~+155℃; LCSC Part Name: 厚膜电阻 4.7kΩ ±5% 100mW; Supplier Part: C3017722; Manufacturer: VO(翔胜); Supplier Footprint: 0603; JLCPCB Part Class: Extended Part; Datasheet: https://atta.szlcsc.com/upload/public/pdf/source/20220513/247AF9639BA21CF93567DC289CCC6A22.pdf; Supplier: LCSC; Type: Thick Film Resistors; Tolerance: ±5%; Operating Temperature Range: -55℃~+155℃
SCREW1-SCREW4 = Screw-Hole-M4: Supplier Footprint: 插件; Check: false
U1 U18 U20 U22 U24 U26 U28 U30 U32 U34 U36 U38 U40 U42 U44 U46 U48 U50 U52 U54 U56 U58 U60 U62 = XJNG2103: Driven Configuration:Half-Bridge Load Type:MOSFET Number of Drivers:2 Current - Output Low(IOL):- Current - Output High(IOH):- Voltage - Supply:9V~20V Voltage - Supply:9V~20V Rise Time:50ns Fall Time:40ns Propagation Delay tpLH:150ns Propagation Delay tpH; LCSC Part Name: 200V、1A半桥驱动器; Supplier Part: C2887735; Manufacturer: NCE(无锡新洁能); Supplier Footprint: SOIC-8; JLCPCB Part Class: Extended Part; Datasheet: https://item.szlcsc.com/datasheet/XJNG2103/3105813.html; Supplier: LCSC; Driven Configuration: Half-Bridge; Load Type: MOSFET; Number of Drivers: 2; Voltage - Supply: 9V~20V; Rise Time: 50ns; Fall Time: 40ns; Propagation Delay tpLH: 150ns; Propagation Delay tpHL: 140ns; Operating Temperature: -40℃~+125℃; Quiescent Current(Iq): 160uA
U2 U19 U21 U23 U25 U27 U29 U31 U33 U35 U37 U39 U41 U43 U45 U47 U49 U51 U53 U55 U57 U59 U61 U63 = 1N5819W_C5451628: Diode Configuration:Independent Voltage - Forward(Vf@If):600mV@200mA Voltage - DC Reverse(Vr):40V Current - Rectified:350mA Reverse Leakage Current (Ir):5uA@30V; LCSC Part Name: 电压:40V 电流:350mA; Supplier Part: C5451628; Manufacturer: HXY MOSFET(华轩阳电子); Supplier Footprint: SOD-123; JLCPCB Part Class: Extended Part; Datasheet: https://item.szlcsc.com/datasheet/1N5819W/6355371.html; Supplier: LCSC; Diode Configuration: Independent; Voltage - Forward(Vf@If): 600mV@200mA; Voltage - DC Reverse(Vr): 40V; Current - Rectified: 350mA; Reverse Leakage Current (Ir): 5uA@30V
U3 = LM2596HVS-12/TR: Function:Step-down type Output Type:Fixed Voltage - Supply:4.5V~40V Voltage - Supply:4.5V~40V Output Voltage:12V Output Voltage:12V Output Current:3A Frequency - Switching:150kHz Frequency - Switching:150kHz Operating Temperature:-40℃~+125℃@(TJ) Operating; Supplier Part: C356715; Manufacturer: HGSEMI(华冠); Supplier Footprint: TO-263-5; JLCPCB Part Class: Extended Part; Datasheet: https://atta.szlcsc.com/upload/public/pdf/source/20200924/C194349_32A49216D05BD4A6AA6EE8DE19C810A9.pdf; Supplier: LCSC; Function: Step-down type; Output Type: Fixed; Voltage - Supply: 4.5V~40V; Output Voltage: 12V; Output Current: 3A; Frequency - Switching: 150kHz; Operating Temperature: -40℃~+125℃@(TJ); Synchronous Rectifier: No; Topology: Step-down; Quiescent Current: 5mA; Switch tube (built-in/external): Built-in
U12 = AMS1117-3.3_C347222: Output Type:Fixed Voltage - Supply:12V Output Voltage:3.3V Output Voltage:3.3V Output Current:1A Power Supply Rejection Ratio (PSRR):60dB@(120Hz) Voltage Dropout:1.3V@(1A) standby current:- Noise:- Features:Overcurrent Protection Operating Temperature:- O; LCSC Part Name: 输出:3.3V 电流:1A 耐压:12V; Supplier Part: C347222; Manufacturer: UMW(友台半导体); Supplier Footprint: SOT-223; JLCPCB Part Class: Extended Part; Datasheet: https://item.szlcsc.com/datasheet/AMS1117-3.3/323882.html; Supplier: LCSC; Output Type: Fixed; Voltage - Supply: 12V; Output Voltage: 3.3V; Output Current: 1A; Power Supply Rejection Ratio (PSRR): 60dB@(120Hz); Voltage Dropout: 1.3V@(1A); Features: Overcurrent Protection; Output Configuration: Positive electrode; Number of Outputs: 1
U14 U15 = MX15EDGRM-3.5-10P-GN01-Cu-A: Connector Type:Receptacle-Close fixed form:Screw Fixing Structure:1x10P Pitch:3.5mm Color:Green Mounting Style:Bend Number of Pins:10P Number of Rows:1 Number of PINs Per Row:10 Current Rating (Max):8A Voltage Rating (Max):300V Operating Temperature Range; LCSC Part Name: 螺丝固定 1x10P 3.5mm 排数:1 每排P数:10; Supplier Part: C5188349; Manufacturer: MAX(迈旭); Supplier Footprint: 弯插,P=3.5mm; JLCPCB Part Class: Extended Part; Datasheet: https://atta.szlcsc.com/upload/public/pdf/source/20230914/88F81637A84810C01DEF4CBC9CB88FF8.pdf; Supplier: LCSC; Connector Type: Receptacle-Close; fixed form: Screw Fixing; Structure: 1x10P; Pitch: 3.5mm; Color: Green; Mounting Style: Bend; Number of Pins: 10P; Number of Rows: 1; Number of PINs Per Row: 10; Current Rating (Max): 8A; Voltage Rating (Max): 300V; Operating Temperature Range: -40℃~+105℃
U17 = SN74LVC1G125DBVR_C23654: output type:Tri-State Voltage - Supply:1.65V~5.5V Voltage - Supply:1.65V~5.5V Number of Elements:1 Number of Bits per Element:1 Current - Output Low(IOL):32mA Current - Output High(IOH):32mA Logic Family:74LVC Operating Temperature:-40℃~+125℃ Operating Te; Supplier Part: C23654; Manufacturer: TI(德州仪器); Supplier Footprint: SOT-23-5; JLCPCB Part Class: Extended Part; Datasheet: https://www.ti.com/cn/lit/gpn/sn74lvc1g125; Supplier: LCSC; output type: Tri-State; Voltage - Supply: 1.65V~5.5V; Number of Elements: 1; Number of Bits per Element: 1; Current - Output Low(IOL): 32mA; Current - Output High(IOH): 32mA; Logic Family: 74LVC; Operating Temperature: -40℃~+125℃

## Nets
+12V: C5.1 C68.2 C69.1 C78.1 C85.1 C91.1 C97.1 C103.1 C109.1 C115.1 C121.1 C127.1 C133.1 C138.1 C145.1 C150.1 C157.1 C162.1 C169.1 C174.1 C181.1 C186.1 C193.1 C198.1 C205.1 C210.1 L1.2 R3.1 R183.2 R186.1 R189.1 R192.1 R195.1 R198.1 R201.1 R204.1 R207.1 R210.1 R213.1 R216.1 R219.1 R222.1 R225.1 R228.1 R231.1 R234.1 R237.1 R240.1 R243.1 R246.1 R249.1 R252.1 U1.1(VCC) U3.4(FEEDBACK) U12.3(VIN) U18.1(VCC) U20.1(VCC) U22.1(VCC) U24.1(VCC) U26.1(VCC) U28.1(VCC) U30.1(VCC) U32.1(VCC) U34.1(VCC) U36.1(VCC) U38.1(VCC) U40.1(VCC) U42.1(VCC) U44.1(VCC) U46.1(VCC) U48.1(VCC) U50.1(VCC) U52.1(VCC) U54.1(VCC) U56.1(VCC) U58.1(VCC) U60.1(VCC) U62.1(VCC)
GND: C5.2 C8.2 C54.2 C62.1 C63.1 C68.1 C69.2 C73.1 C78.2 C85.2 C91.2 C97.2 C103.2 C109.2 C115.2 C121.2 C127.2 C133.2 C138.2 C145.2 C150.2 C157.2 C162.2 C169.2 C174.2 C181.2 C186.2 C193.2 C198.2 C205.2 C210.2 D2.2(A) F25.2 LED40.1(C) Q5.1(S) Q5.2(S) Q5.3(S) Q24.5(D) U1.4(COM) U3.3(GROUND) U3.5(ON/OFF) U3.6(GND) U12.1(ADJ(GND)) U17.3(GND) U18.4(COM) U20.4(COM) U22.4(COM) U24.4(COM) U26.4(COM) U28.4(COM) U30.4(COM) U32.4(COM) U34.4(COM) U36.4(COM) U38.4(COM) U40.4(COM) U42.4(COM) U44.4(COM) U46.4(COM) U48.4(COM) U50.4(COM) U52.4(COM) U54.4(COM) U56.4(COM) U58.4(COM) U60.4(COM) U62.4(COM)
VCC: C54.1 C62.2 C73.2 U12.2(VOUT(TAB)) U12.4(TAB) U17.5(VCC)
ACT_BAL_EN: U15.9 U17.1(OE)
ACT_BAL_PWM: U15.10 U17.2(A)
B1+: C79.2 C80.1 F26.1 U14.2
B1-: C79.1 C104.2 F25.1 U14.1
B2+: C80.2 C139.1 F27.1 U14.3
B3+: C139.2 C140.1 F28.1 U14.4
B4+: C140.2 C175.1 F29.1 U14.5
B5+: C175.2 C176.1 F30.1 U14.6
B6+: C176.2 C187.1 F31.1 U14.7
B7+: C187.2 C188.1 F32.1 U14.8
B8+: C188.2 C199.1 F33.1 U14.9
B9+: C199.2 C200.1 F34.1 U15.1
B10+: C200.2 C211.1 F35.1 U15.2
B11+: C211.2 C212.1 F36.1 U15.3
B12+: C151.1 C212.2 F37.1 U15.4
B13+: C151.2 C152.1 F38.1 U15.5
B14+: C152.2 C163.1 F39.1 U15.6
B15+: C163.2 C164.1 F40.1 U15.7
B16+: C110.1 C164.2 F41.1 U15.8
BAL_SIG: U1.2(HIN) U1.3(LIN#) U17.4(Y) U18.2(HIN) U18.3(LIN#) U20.2(HIN) U20.3(LIN#) U22.2(HIN) U22.3(LIN#) U24.2(HIN) U24.3(LIN#) U26.2(HIN) U26.3(LIN#) U28.2(HIN) U28.3(LIN#) U30.2(HIN) U30.3(LIN#) U32.2(HIN) U32.3(LIN#) U34.2(HIN) U34.3(LIN#) U36.2(HIN) U36.3(LIN#) U38.2(HIN) U38.3(LIN#) U40.2(HIN) U40.3(LIN#) U42.2(HIN) U42.3(LIN#) U44.2(HIN) U44.3(LIN#) U46.2(HIN) U46.3(LIN#) U48.2(HIN) U48.3(LIN#) U50.2(HIN) U50.3(LIN#) U52.2(HIN) U52.3(LIN#) U54.2(HIN) U54.3(LIN#) U56.2(HIN) U56.3(LIN#) U58.2(HIN) U58.3(LIN#) U60.2(HIN) U60.3(LIN#) U62.2(HIN) U62.3(LIN#)
BN1+: C110.2 C116.1 CN1.1 F42.1
BN2+: C116.2 C122.1 CN1.2 F43.1
BN3+: C122.2 C128.1 CN1.3 F44.1
BN4+: C128.2 CN1.4 F45.1
BP12+: C86.1 CN2.1 F46.1
BP13+: C86.2 C92.1 CN2.2 F47.1
BP14+: C92.2 C98.1 CN2.3 F48.1
BP15+: C98.2 C104.1 CN2.4 F49.1
C+: Q6.1(S) Q6.2(S) Q6.3(S) Q10.1(S) Q10.2(S) Q10.3(S) Q14.1(S) Q14.2(S) Q14.3(S) Q18.1(S) Q18.2(S) Q18.3(S) Q22.1(S) Q22.2(S) Q22.3(S) Q26.1(S) Q26.2(S) Q26.3(S) Q30.1(S) Q30.2(S) Q30.3(S) Q34.1(S) Q34.2(S) Q34.3(S) Q38.1(S) Q38.2(S) Q38.3(S) Q42.1(S) Q42.2(S) Q42.3(S) Q46.1(S) Q46.2(S) Q46.3(S) Q50.1(S) Q50.2(S) Q50.3(S) Q54.1(S) Q54.2(S) Q54.3(S) Q58.1(S) Q58.2(S) Q58.3(S) Q62.1(S) Q62.2(S) Q62.3(S) Q66.1(S) Q66.2(S) Q66.3(S) Q70.1(S) Q70.2(S) Q70.3(S) Q74.1(S) Q74.2(S) Q74.3(S) Q78.1(S) Q78.2(S) Q78.3(S) Q82.1(S) Q82.2(S) Q82.3(S) Q86.1(S) Q86.2(S) Q86.3(S) Q90.1(S) Q90.2(S) Q90.3(S) Q94.1(S) Q94.2(S) Q94.3(S) Q98.1(S) Q98.2(S) Q98.3(S)
C-: Q7.1(S) Q7.2(S) Q7.3(S) Q11.1(S) Q11.2(S) Q11.3(S) Q15.1(S) Q15.2(S) Q15.3(S) Q19.1(S) Q19.2(S) Q19.3(S) Q23.1(S) Q23.2(S) Q23.3(S) Q27.1(S) Q27.2(S) Q27.3(S) Q31.1(S) Q31.2(S) Q31.3(S) Q35.1(S) Q35.2(S) Q35.3(S) Q39.1(S) Q39.2(S) Q39.3(S) Q43.1(S) Q43.2(S) Q43.3(S) Q47.1(S) Q47.2(S) Q47.3(S) Q51.1(S) Q51.2(S) Q51.3(S) Q55.1(S) Q55.2(S) Q55.3(S) Q59.1(S) Q59.2(S) Q59.3(S) Q63.1(S) Q63.2(S) Q63.3(S) Q67.1(S) Q67.2(S) Q67.3(S) Q71.1(S) Q71.2(S) Q71.3(S) Q75.1(S) Q75.2(S) Q75.3(S) Q79.1(S) Q79.2(S) Q79.3(S) Q83.1(S) Q83.2(S) Q83.3(S) Q87.1(S) Q87.2(S) Q87.3(S) Q91.1(S) Q91.2(S) Q91.3(S) Q95.1(S) Q95.2(S) Q95.3(S) Q99.1(S) Q99.2(S) Q99.3(S)
FU_B1+: F26.2 Q4.5(D) Q9.1(S) Q9.2(S) Q9.3(S)
FU_B2+: F27.2 Q8.5(D) Q45.1(S) Q45.2(S) Q45.3(S)
FU_B3+: F28.2 Q44.5(D) Q49.1(S) Q49.2(S) Q49.3(S)
FU_B4+: F29.2 Q48.5(D) Q69.1(S) Q69.2(S) Q69.3(S)
FU_B5+: F30.2 Q68.5(D) Q73.1(S) Q73.2(S) Q73.3(S)
FU_B6+: F31.2 Q72.5(D) Q77.1(S) Q77.2(S) Q77.3(S)
FU_B7+: F32.2 Q76.5(D) Q81.1(S) Q81.2(S) Q81.3(S)
FU_B8+: F33.2 Q80.5(D) Q85.1(S) Q85.2(S) Q85.3(S)
FU_B9+: F34.2 Q84.5(D) Q89.1(S) Q89.2(S) Q89.3(S)
FU_B10+: F35.2 Q88.5(D) Q93.1(S) Q93.2(S) Q93.3(S)
FU_B11+: F36.2 Q92.5(D) Q97.1(S) Q97.2(S) Q97.3(S)
FU_B12+: F37.2 Q53.1(S) Q53.2(S) Q53.3(S) Q96.5(D)
FU_B13+: F38.2 Q52.5(D) Q57.1(S) Q57.2(S) Q57.3(S)
FU_B14+: F39.2 Q56.5(D) Q61.1(S) Q61.2(S) Q61.3(S)
FU_B15+: F40.2 Q60.5(D) Q65.1(S) Q65.2(S) Q65.3(S)
FU_B16+: C8.1 C63.2 F41.2 Q29.1(S) Q29.2(S) Q29.3(S) Q64.5(D) U3.1(VIN)
FU_BN1+: F42.2 Q28.5(D) Q33.1(S) Q33.2(S) Q33.3(S)
FU_BN2+: F43.2 Q32.5(D) Q37.1(S) Q37.2(S) Q37.3(S)
FU_BN3+: F44.2 Q36.5(D) Q41.1(S) Q41.2(S) Q41.3(S)
FU_BN4+: F45.2 Q40.5(D)
FU_BP12+: F46.2 Q13.1(S) Q13.2(S) Q13.3(S)
FU_BP13+: F47.2 Q12.5(D) Q17.1(S) Q17.2(S) Q17.3(S)
FU_BP14+: F48.2 Q16.5(D) Q21.1(S) Q21.2(S) Q21.3(S)
FU_BP15+: F49.2 Q20.5(D) Q25.1(S) Q25.2(S) Q25.3(S)
$1N1680: C1.1 C2.1 C3.1 C4.2 Q4.1(S) Q4.2(S) Q4.3(S) Q6.5(D) U1.6(VS)
$1N1726: C1.2 C2.2 C3.2 Q5.5(D) Q7.5(D)
$1N2017: R1.1 U1.7(HO)
$1N2024: Q4.4(G) Q5.4(G) R1.2
$1N2051: R2.1 U1.5(LO)
$1N2060: Q6.4(G) Q7.4(G) R2.2
$1N2229: R3.2 U2.1(A)
$1N2279: C4.1 U1.8(VB) U2.2(K)
$1N3207: D2.1(K) L1.1 U3.2(OUTPUT)
$1N3214: LED40.2(A) R183.1
$1N5527: C74.1 C75.1 C76.1 C77.2 Q8.1(S) Q8.2(S) Q8.3(S) Q10.5(D) U18.6(VS)
$1N5544: C74.2 C75.2 C76.2 Q9.5(D) Q11.5(D)
$1N5562: R184.1 U18.7(HO)
$1N5565: Q8.4(G) Q9.4(G) R184.2
$1N5571: R185.1 U18.5(LO)
$1N5574: Q10.4(G) Q11.4(G) R185.2
$1N5581: R186.2 U19.1(A)
$1N5583: C77.1 U18.8(VB) U19.2(K)
$1N6447: C81.1 C82.1 C83.1 C84.2 Q12.1(S) Q12.2(S) Q12.3(S) Q14.5(D) U20.6(VS)
$1N6464: C81.2 C82.2 C83.2 Q13.5(D) Q15.5(D)
$1N6482: R187.1 U20.7(HO)
$1N6485: Q12.4(G) Q13.4(G) R187.2
$1N6491: R188.1 U20.5(LO)
$1N6494: Q14.4(G) Q15.4(G) R188.2
$1N6501: R189.2 U21.1(A)
$1N6503: C84.1 U20.8(VB) U21.2(K)
$1N7147: C87.1 C88.1 C89.1 C90.2 Q16.1(S) Q16.2(S) Q16.3(S) Q18.5(D) U22.6(VS)
$1N7164: C87.2 C88.2 C89.2 Q17.5(D) Q19.5(D)
$1N7182: R190.1 U22.7(HO)
$1N7185: Q16.4(G) Q17.4(G) R190.2
$1N7191: R191.1 U22.5(LO)
$1N7194: Q18.4(G) Q19.4(G) R191.2
$1N7201: R192.2 U23.1(A)
$1N7203: C90.1 U22.8(VB) U23.2(K)
$1N7847: C93.1 C94.1 C95.1 C96.2 Q20.1(S) Q20.2(S) Q20.3(S) Q22.5(D) U24.6(VS)
$1N7864: C93.2 C94.2 C95.2 Q21.5(D) Q23.5(D)
$1N7882: R193.1 U24.7(HO)
$1N7885: Q20.4(G) Q21.4(G) R193.2
$1N7891: R194.1 U24.5(LO)
$1N7894: Q22.4(G) Q23.4(G) R194.2
$1N7901: R195.2 U25.1(A)
$1N7903: C96.1 U24.8(VB) U25.2(K)
$1N8547: C99.1 C100.1 C101.1 C102.2 Q24.1(S) Q24.2(S) Q24.3(S) Q26.5(D) U26.6(VS)
$1N8564: C99.2 C100.2 C101.2 Q25.5(D) Q27.5(D)
$1N8582: R196.1 U26.7(HO)
$1N8585: Q24.4(G) Q25.4(G) R196.2
$1N8591: R197.1 U26.5(LO)
$1N8594: Q26.4(G) Q27.4(G) R197.2
$1N8601: R198.2 U27.1(A)
$1N8603: C102.1 U26.8(VB) U27.2(K)
$1N11756: C105.1 C106.1 C107.1 C108.2 Q28.1(S) Q28.2(S) Q28.3(S) Q30.5(D) U28.6(VS)
$1N11773: C105.2 C106.2 C107.2 Q29.5(D) Q31.5(D)
$1N11791: R199.1 U28.7(HO)
$1N11794: Q28.4(G) Q29.4(G) R199.2
$1N11800: R200.1 U28.5(LO)
$1N11803: Q30.4(G) Q31.4(G) R200.2
$1N11810: R201.2 U29.1(A)
$1N11812: C108.1 U28.8(VB) U29.2(K)
$1N11851: C111.1 C112.1 C113.1 C114.2 Q32.1(S) Q32.2(S) Q32.3(S) Q34.5(D) U30.6(VS)
$1N11868: C111.2 C112.2 C113.2 Q33.5(D) Q35.5(D)
$1N11886: R202.1 U30.7(HO)
$1N11889: Q32.4(G) Q33.4(G) R202.2
$1N11895: R203.1 U30.5(LO)
$1N11898: Q34.4(G) Q35.4(G) R203.2
$1N11905: R204.2 U31.1(A)
$1N11907: C114.1 U30.8(VB) U31.2(K)
$1N11946: C117.1 C118.1 C119.1 C120.2 Q36.1(S) Q36.2(S) Q36.3(S) Q38.5(D) U32.6(VS)
$1N11963: C117.2 C118.2 C119.2 Q37.5(D) Q39.5(D)
$1N11981: R205.1 U32.7(HO)
$1N11984: Q36.4(G) Q37.4(G) R205.2
$1N11990: R206.1 U32.5(LO)
$1N11993: Q38.4(G) Q39.4(G) R206.2
$1N12000: R207.2 U33.1(A)
$1N12002: C120.1 U32.8(VB) U33.2(K)
$1N12041: C123.1 C124.1 C125.1 C126.2 Q40.1(S) Q40.2(S) Q40.3(S) Q42.5(D) U34.6(VS)
$1N12058: C123.2 C124.2 C125.2 Q41.5(D) Q43.5(D)
$1N12076: R208.1 U34.7(HO)
$1N12079: Q40.4(G) Q41.4(G) R208.2
$1N12085: R209.1 U34.5(LO)
$1N12088: Q42.4(G) Q43.4(G) R209.2
$1N12095: R210.2 U35.1(A)
$1N12097: C126.1 U34.8(VB) U35.2(K)
$1N13354: C129.1 C130.1 C131.1 C132.2 Q44.1(S) Q44.2(S) Q44.3(S) Q46.5(D) U36.6(VS)
$1N13371: C129.2 C130.2 C131.2 Q45.5(D) Q47.5(D)
$1N13389: R211.1 U36.7(HO)
$1N13392: Q44.4(G) Q45.4(G) R211.2
$1N13398: R212.1 U36.5(LO)
$1N13401: Q46.4(G) Q47.4(G) R212.2
$1N13408: R213.2 U37.1(A)
$1N13410: C132.1 U36.8(VB) U37.2(K)
$1N13440: C134.1 C135.1 C136.1 C137.2 Q48.1(S) Q48.2(S) Q48.3(S) Q50.5(D) U38.6(VS)
$1N13457: C134.2 C135.2 C136.2 Q49.5(D) Q51.5(D)
$1N13475: R214.1 U38.7(HO)
$1N13478: Q48.4(G) Q49.4(G) R214.2
$1N13484: R215.1 U38.5(LO)
$1N13487: Q50.4(G) Q51.4(G) R215.2
$1N13494: R216.2 U39.1(A)
$1N13496: C137.1 U38.8(VB) U39.2(K)
$1N15960: C141.1 C142.1 C143.1 C144.2 Q52.1(S) Q52.2(S) Q52.3(S) Q54.5(D) U40.6(VS)
$1N15977: C141.2 C142.2 C143.2 Q53.5(D) Q55.5(D)
$1N15995: R217.1 U40.7(HO)
$1N15998: Q52.4(G) Q53.4(G) R217.2
$1N16004: R218.1 U40.5(LO)
$1N16007: Q54.4(G) Q55.4(G) R218.2
$1N16014: R219.2 U41.1(A)
$1N16016: C144.1 U40.8(VB) U41.2(K)
$1N16046: C146.1 C147.1 C148.1 C149.2 Q56.1(S) Q56.2(S) Q56.3(S) Q58.5(D) U42.6(VS)
$1N16063: C146.2 C147.2 C148.2 Q57.5(D) Q59.5(D)
$1N16081: R220.1 U42.7(HO)
$1N16084: Q56.4(G) Q57.4(G) R220.2
$1N16090: R221.1 U42.5(LO)
$1N16093: Q58.4(G) Q59.4(G) R221.2
$1N16100: R222.2 U43.1(A)
$1N16102: C149.1 U42.8(VB) U43.2(K)
$1N16150: C153.1 C154.1 C155.1 C156.2 Q60.1(S) Q60.2(S) Q60.3(S) Q62.5(D) U44.6(VS)
$1N16167: C153.2 C154.2 C155.2 Q61.5(D) Q63.5(D)
$1N16185: R223.1 U44.7(HO)
$1N16188: Q60.4(G) Q61.4(G) R223.2
$1N16194: R224.1 U44.5(LO)
$1N16197: Q62.4(G) Q63.4(G) R224.2
$1N16204: R225.2 U45.1(A)
$1N16206: C156.1 U44.8(VB) U45.2(K)
$1N16236: C158.1 C159.1 C160.1 C161.2 Q64.1(S) Q64.2(S) Q64.3(S) Q66.5(D) U46.6(VS)
$1N16253: C158.2 C159.2 C160.2 Q65.5(D) Q67.5(D)
$1N16271: R226.1 U46.7(HO)
$1N16274: Q64.4(G) Q65.4(G) R226.2
$1N16280: R227.1 U46.5(LO)
$1N16283: Q66.4(G) Q67.4(G) R227.2
$1N16290: R228.2 U47.1(A)
$1N16292: C161.1 U46.8(VB) U47.2(K)
$1N48174: C165.1 C166.1 C167.1 C168.2 Q68.1(S) Q68.2(S) Q68.3(S) Q70.5(D) U48.6(VS)
$1N48175: C165.2 C166.2 C167.2 Q69.5(D) Q71.5(D)
$1N48180: R229.1 U48.7(HO)
$1N48181: Q68.4(G) Q69.4(G) R229.2
$1N48182: R230.1 U48.5(LO)
$1N48183: Q70.4(G) Q71.4(G) R230.2
$1N48184: R231.2 U49.1(A)
$1N48185: C168.1 U48.8(VB) U49.2(K)
$1N48192: C170.1 C171.1 C172.1 C173.2 Q72.1(S) Q72.2(S) Q72.3(S) Q74.5(D) U50.6(VS)
$1N48193: C170.2 C171.2 C172.2 Q73.5(D) Q75.5(D)
$1N48198: R232.1 U50.7(HO)
$1N48199: Q72.4(G) Q73.4(G) R232.2
$1N48200: R233.1 U50.5(LO)
$1N48201: Q74.4(G) Q75.4(G) R233.2
$1N48202: R234.2 U51.1(A)
$1N48203: C173.1 U50.8(VB) U51.2(K)
$1N48226: C177.1 C178.1 C179.1 C180.2 Q76.1(S) Q76.2(S) Q76.3(S) Q78.5(D) U52.6(VS)
$1N48227: C177.2 C178.2 C179.2 Q77.5(D) Q79.5(D)
$1N48232: R235.1 U52.7(HO)
$1N48233: Q76.4(G) Q77.4(G) R235.2
$1N48234: R236.1 U52.5(LO)
$1N48235: Q78.4(G) Q79.4(G) R236.2
$1N48236: R237.2 U53.1(A)
$1N48237: C180.1 U52.8(VB) U53.2(K)
$1N48244: C182.1 C183.1 C184.1 C185.2 Q80.1(S) Q80.2(S) Q80.3(S) Q82.5(D) U54.6(VS)
$1N48245: C182.2 C183.2 C184.2 Q81.5(D) Q83.5(D)
$1N48250: R238.1 U54.7(HO)
$1N48251: Q80.4(G) Q81.4(G) R238.2
$1N48252: R239.1 U54.5(LO)
$1N48253: Q82.4(G) Q83.4(G) R239.2
$1N48254: R240.2 U55.1(A)
$1N48255: C185.1 U54.8(VB) U55.2(K)
$1N48278: C189.1 C190.1 C191.1 C192.2 Q84.1(S) Q84.2(S) Q84.3(S) Q86.5(D) U56.6(VS)
$1N48279: C189.2 C190.2 C191.2 Q85.5(D) Q87.5(D)
$1N48284: R241.1 U56.7(HO)
$1N48285: Q84.4(G) Q85.4(G) R241.2
$1N48286: R242.1 U56.5(LO)
$1N48287: Q86.4(G) Q87.4(G) R242.2
$1N48288: R243.2 U57.1(A)
$1N48289: C192.1 U56.8(VB) U57.2(K)
$1N48296: C194.1 C195.1 C196.1 C197.2 Q88.1(S) Q88.2(S) Q88.3(S) Q90.5(D) U58.6(VS)
$1N48297: C194.2 C195.2 C196.2 Q89.5(D) Q91.5(D)
$1N48302: R244.1 U58.7(HO)
$1N48303: Q88.4(G) Q89.4(G) R244.2
$1N48304: R245.1 U58.5(LO)
$1N48305: Q90.4(G) Q91.4(G) R245.2
$1N48306: R246.2 U59.1(A)
$1N48307: C197.1 U58.8(VB) U59.2(K)
$1N48330: C201.1 C202.1 C203.1 C204.2 Q92.1(S) Q92.2(S) Q92.3(S) Q94.5(D) U60.6(VS)
$1N48331: C201.2 C202.2 C203.2 Q93.5(D) Q95.5(D)
$1N48336: R247.1 U60.7(HO)
$1N48337: Q92.4(G) Q93.4(G) R247.2
$1N48338: R248.1 U60.5(LO)
$1N48339: Q94.4(G) Q95.4(G) R248.2
$1N48340: R249.2 U61.1(A)
$1N48341: C204.1 U60.8(VB) U61.2(K)
$1N48348: C206.1 C207.1 C208.1 C209.2 Q96.1(S) Q96.2(S) Q96.3(S) Q98.5(D) U62.6(VS)
$1N48349: C206.2 C207.2 C208.2 Q97.5(D) Q99.5(D)
$1N48354: R250.1 U62.7(HO)
$1N48355: Q96.4(G) Q97.4(G) R250.2
$1N48356: R251.1 U62.5(LO)
$1N48357: Q98.4(G) Q99.4(G) R251.2
$1N48358: R252.2 U63.1(A)
$1N48359: C209.1 U62.8(VB) U63.2(K)

Not connected (* = marked no-connect by the designer): SCREW1 1; SCREW2 1; SCREW3 1; SCREW4 1; U14 10

## Notes on the sheets
sheet 1
- Power supply
